# Altium schematic sheet LED and LCD.SchDoc
size A4
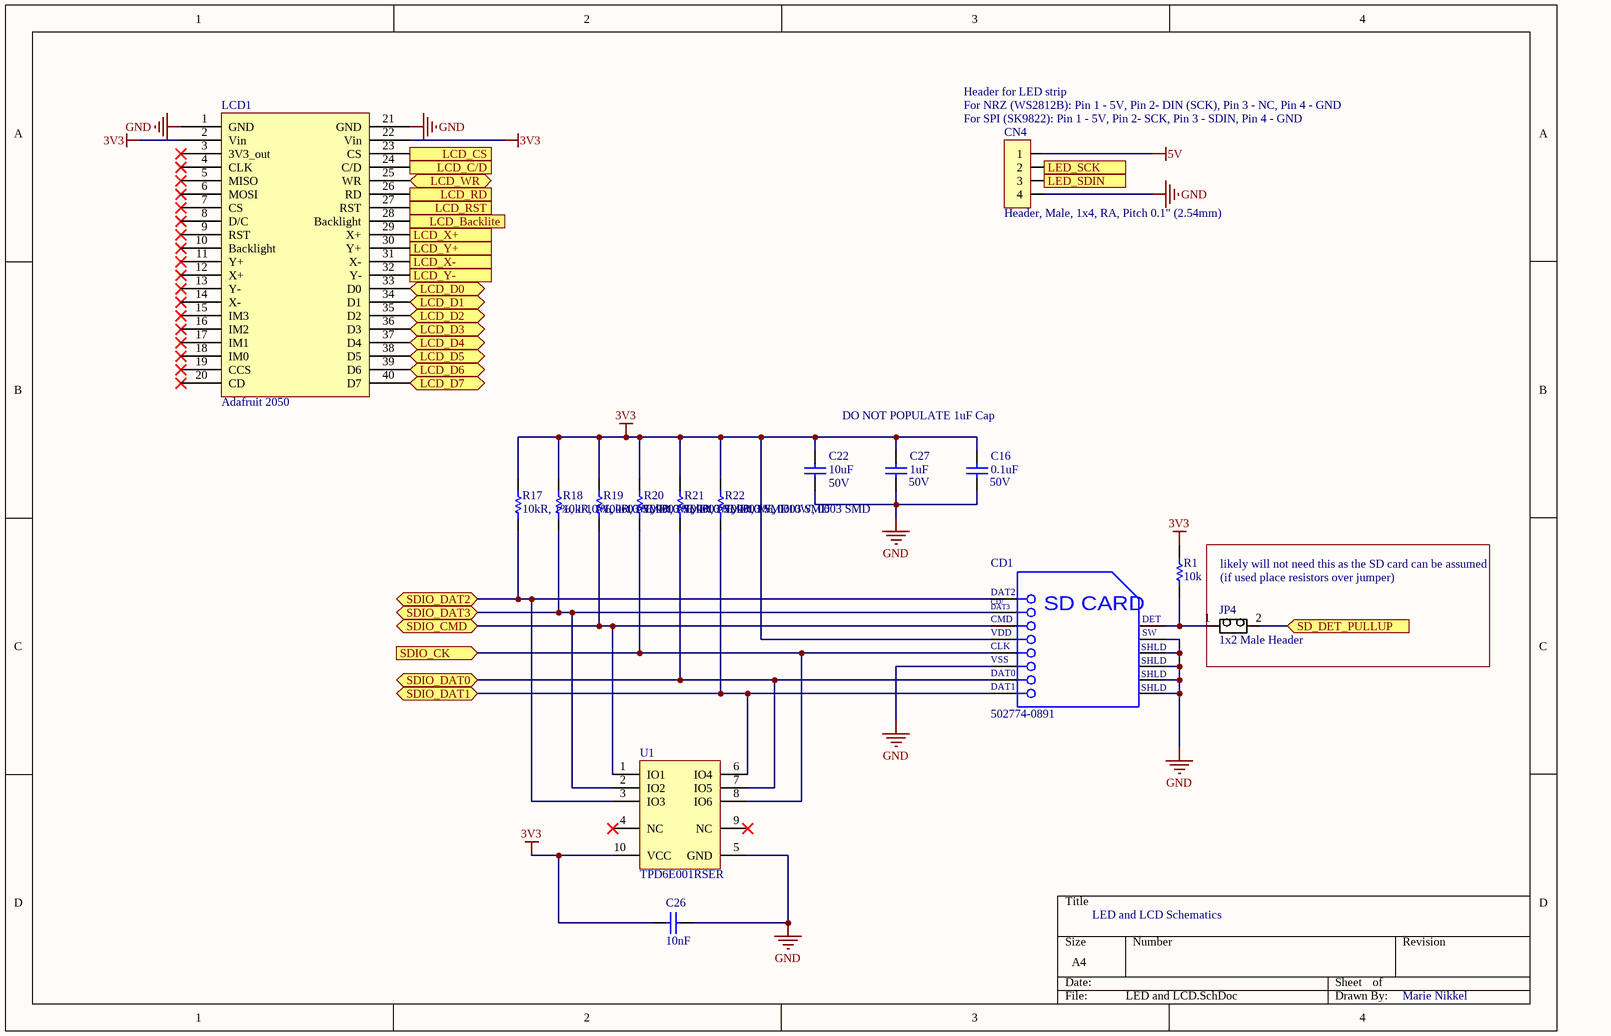
[diagram p0: LED and LCD.SchDoc]

## Parts
C16  Voltage: 50V  Capacitance: 0.1uF  [FP-CL10-0_1-IPC_A]  (hidden comment: CL10B104JB8NNNC)
C22  Voltage Rating (DC): 50V  Capacitance: 10uF  [CAPC3216X180X50ML20T30]  (hidden comment: CL31B106KBHNNNE)
C26  value 10nF  [CAPC1608N(0603")]  (hidden comment: 10 nF, 50V 0603 SMD, Ceramic)
C27  Capacitance: 1uF  Voltage: 50V  [0803 CAP]  (hidden comment: CL21B105KBFNNNG)
CD1  502774-0891  [MOLX-502774-0891_V]
CN4  Header, Male, 1x4, RA, Pitch 0.1" (2.54mm)  [HEADER, MALE, SHROUDED, 4x1, PITCH 0.1" (2.54mm), RA]
JP4  1x2 Male Header  [2X1 Males Header]
LCD1  Adafruit 2050  [LCD_touchscreen_tft]
R1  value 10k  [RESC1608N(0603")]  (hidden comment: 10kR, 1%, 1/10W, 0603 SMD)
R17  10kR, 1%, 1/10W, 0603 SMD  [RESC1608N(0603")]
R18  10kR, 1%, 1/10W, 0603 SMD  [RESC1608N(0603")]
R19  10kR, 1%, 1/10W, 0603 SMD  [RESC1608N(0603")]
R20  10kR, 1%, 1/10W, 0603 SMD  [RESC1608N(0603")]
R21  10kR, 1%, 1/10W, 0603 SMD  [RESC1608N(0603")]
R22  10kR, 1%, 1/10W, 0603 SMD  [RESC1608N(0603")]
U1  TPD6E001RSER  [RSE0010A_V]

## Ports
LCD_Backlite (in), LCD_C/D (in), LCD_CS (in), LCD_D0 (bidir), LCD_D1 (bidir), LCD_D2 (bidir), LCD_D3 (bidir), LCD_D4 (bidir), LCD_D5 (bidir), LCD_D6 (bidir), LCD_D7 (bidir), LCD_RD (in), LCD_RST (in), LCD_WR (bidir), LCD_X+ (out), LCD_X- (out), LCD_Y+ (out), LCD_Y- (out), LED_SCK (in), LED_SDIN (in), SD_DET_PULLUP (in), SDIO_CK (in), SDIO_CMD (bidir), SDIO_DAT0 (bidir), SDIO_DAT1 (bidir), SDIO_DAT2 (bidir), SDIO_DAT3 (bidir)

## Nets
3V3: C16.2 C22.2 C26.1(Anode) C27.2 CD1.4(VDD) LCD1.2(Vin) LCD1.22(Vin) R1.2 R17.2 R18.2 R19.2 R20.2 R21.2 R22.2 U1.10(VCC)
5V: CN4.1
GND: C16.1 C22.1 C26.2(Cathode) C27.1 CD1.6(VSS) CD1.10(SWITCH) CD1.11(SHLD) CD1.12(SHLD) CD1.13(SHLD) CD1.14(SHLD) CN4.4 LCD1.1(GND) LCD1.21(GND) U1.5(GND)
LCD_Backlite: LCD1.28(Backlight) ; port LCD_Backlite
LCD_C/D: LCD1.24(C/D) ; port LCD_C/D
LCD_CS: LCD1.23(CS) ; port LCD_CS
LCD_D0: LCD1.33(D0) ; port LCD_D0
LCD_D1: LCD1.34(D1) ; port LCD_D1
LCD_D2: LCD1.35(D2) ; port LCD_D2
LCD_D3: LCD1.36(D3) ; port LCD_D3
LCD_D4: LCD1.37(D4) ; port LCD_D4
LCD_D5: LCD1.38(D5) ; port LCD_D5
LCD_D6: LCD1.39(D6) ; port LCD_D6
LCD_D7: LCD1.40(D7) ; port LCD_D7
LCD_RD: LCD1.26(RD) ; port LCD_RD
LCD_RST: LCD1.27(RST) ; port LCD_RST
LCD_WR: LCD1.25(WR) ; port LCD_WR
LCD_X+: LCD1.29(X+) ; port LCD_X+
LCD_X-: LCD1.31(X-) ; port LCD_X-
LCD_Y+: LCD1.30(Y+) ; port LCD_Y+
LCD_Y-: LCD1.32(Y-) ; port LCD_Y-
LED_SCK: CN4.2 ; port LED_SCK
LED_SDIN: CN4.3 ; port LED_SDIN
SD_DET_PULLUP: JP4.2 ; port SD_DET_PULLUP
SDIO_CK: CD1.5(CLK) R20.1 U1.8(IO6) ; port SDIO_CK
SDIO_CMD: CD1.3(CMD) R19.1 U1.1(IO1) ; port SDIO_CMD
SDIO_DAT0: CD1.7(DAT0) R21.1 U1.7(IO5) ; port SDIO_DAT0
SDIO_DAT1: CD1.8(DAT1) R22.1 U1.6(IO4) ; port SDIO_DAT1
SDIO_DAT2: CD1.1(DAT2) R17.1 U1.3(IO3) ; port SDIO_DAT2
SDIO_DAT3: CD1.2(CD/DAT3) R18.1 U1.2(IO2) ; port SDIO_DAT3
NetCD1_9: CD1.9(DETECT) JP4.1 R1.1

Not connected (* = marked no-connect by the designer): LCD1 3(3V3_out)* 4(CLK)* 5(MISO)* 6(MOSI)* 7(CS)* 8(D/C)* 9(RST)* 10(Backlight)* 11(Y+)* 12(X+)* 13(Y-)* 14(X-)* 15(IM3)* 16(IM2)* 17(IM1)* 18(IM0)* 19(CCS)* 20(CD)*; U1 4(NC)* 9(NC)*

## Notes on the sheet
- Header for LED strip
- (near CN4) For NRZ (WS2812B): Pin 1 - 5V, Pin 2- DIN (SCK), Pin 3 - NC, Pin 4 - GND
- (near CN4) For SPI (SK9822): Pin 1 - 5V, Pin 2- SCK, Pin 3 - SDIN, Pin 4 - GND
- DO NOT POPULATE 1uF Cap
- likely will not need this as the SD card can be assumed
- (if used place resistors over jumper)
- LED and LCD Schematics
- Marie Nikkel
- (in symbol CMP-2000-05248-1) CD/; DAT3; SD CARD; DET; SW

## Library data of the parts
C16 = CMP-00000-3: CAP CER 0.1UF 50V X7R 0603; Tolerance: 5%; Material: Ceramic; Case Code (Imperial): 0603; Mount: Surface Mount; Thickness: 0.035inch; Depth: 0.8mm; Packaging: Tape and Reel; Package Quantity: 1; Dielectric: X7R; Height: 0.8mm; Radiation Hardening: No; Max Operating Temperature: 125°C; Voltage Rating: 50V; Case/Package: 0603; Min Operating Temperature: -55°C; Case Code (Metric): 1608; Length: 1.6mm; Contact Plating: Tin; Width: 0.031inch
C22 = CMP-00004-1: Cap Ceramic 10uF 50V X7R 10% Pad SMD 1206 125°C T/R; Thickness: 0.071inch; Case/Package: 1206; Case Code (Metric): 3216; Case Code (Imperial): 1206; Voltage Rating: 50V; Length: 0.126inch; Max Operating Temperature: 125°C; Dielectric: X7R; Lead Free: Lead Free; Min Operating Temperature: -55°C; Tolerance: 10%; Mount: Surface Mount; Packaging: Tape and Reel; Width: 0.063inch
C26 = CMP-006-0010-1: Capacitor, Ceramic, 50V, +/- 10%, 0603 SMD; MFG: Samsung; MFG#: GRM188R61A475KE15D; Created By: Gabriel; Design Item ID: 10 nF, 50V 0603 SMD, Ceramic; PackageDescription: Chip Capacitor; Source: AUVic_Schematic_Library_Capacitors.SchLib; Published: 16-06-23; Pin Count: 2; Publisher: AUVic; Component Type: Standard
C27 = CMP-00005-3: SAMSUNG ELECTRO-MECHANICS - CL21B105KBFNNNG - MLCC CAPACITORS; Dielectric: X7R; Tolerance: 10%; Material: Ceramic; Min Operating Temperature: -55°C; Length: 2mm; Termination: Wraparound; Contact Plating: Tin; Package Quantity: 3000; Mount: Surface Mount; Max Operating Temperature: 125°C; Case Code (Imperial): 0805; Thickness: 0.053inch; Case/Package: 0805; Width: 0.049inch; Voltage Rating: 50V; Depth: 1.25mm; Packaging: Tape and Reel; Case Code (Metric): 2012
CD1 = CMP-2000-05248-1: Micro SD Memory Card Connector, 0.5 A, 10 V (DC), -25 to 85 degC, 8-Pin SMT, RoHS, Tape and Reel; Manufacturer: Molex; 3D Model: 502774-0891.stp; Online Catalog: microSD™Series; Number of Positions: 10(8+2); Card Type: SecureDigital-microSD™; Insertion, Removal Method: PushIn,PushOut; Other Names: WM24066DKR; Connector Type: ConnectorandEjector; Features: Switch; Family: MemoryConnectors-PCCardSockets; Manufacturer URL: http://www.molex.com/; Mounting Type: SurfaceMount,RightAngle; Contact Finish Thickness: 20µin(0.51µm); Standard Package: 1; Series: 502774; Ejector Side: -; Datasheet Version: Rev. D, 04/2004; Category: Connectors,Interconnects; Contact Finish: Gold; Datasheet URL: https://datasheet.ciiva.com/1104/1499551-1104671.pdf; RoHS Information: 502774-0891CertofCompliance; Mounting Feature: Reverse-Bottom; Packaging: Digi-Reel; Height Above Board: 0.071"(1.80mm); Catalog Drawings: 502774-0891
CN4 = CMP-005-0029-3: Connector Header Through Hole, Right Angle 4 position 0.100" (2.54mm); Pin Count: 4; Source: AUVic_Schematic_Library_Connectors.SchLib; Created On: 2020-05-20; Design Item ID: Header, Male, 1x4, RA, Pitch 0.1" (2.54mm); Component Type: Standard; Created By: Miguel Manguerra
JP4 = CMP-004-0001-1: Made By: Andy Bates; Source: AUVic_Schematic_Library_Connectors.SchLib; Pin Count: 2; Design Item ID: 1x2 Male Header; Component Type: Standard
LCD1 = CMP-033-0000-6: 3.5" TFT 320X480 TOUCHSCREEN; Component Type: Standard; ComponentLink5Description: Adafruit Guide; ComponentLink1URL: https://www.adafruit.com/product/1743; ComponentLink2URL: https://cdn-shop.adafruit.com/datasheets/ILI9341.pdf; ComponentLink3URL: https://cdn-shop.adafruit.com/datasheets/MI0283QT-11+V1.1.PDF; ComponentLink4URL: https://www.digikey.ca/products/en/optoelectronics/display-modules-lcd-oled-graphic/107?k=&pkeyword=&pv652=165&FV=ffe0006b%2Cfffc05f8&quantity=0&ColumnSort=0&page=1&pageSize=25; ComponentLink3Description: Raw LCD Datasheet; ComponentLink4Description: DigiKey; Pin Count: 40; ComponentLink5URL: https://cdn-learn.adafruit.com/downloads/pdf/adafruit-2-dot-8-color-tft-touchscreen-breakout-v2.pdf; ComponentLink1Description: Adafruit; Design Item ID: Adafruit 2050; ComponentLink2Description: Datasheet; Source: AUVic_Integrated_Library_LCDs.SchLib
R1 = CMP-047-0013-1: Owned By: AUVic; Made By: Ashwin Sira; Design Item ID: 10kR, 1%, 1/10W, 0603 SMD; Pin Count: 2; Component Type: Standard; Created On: 14-05-31; Last Edited: 14-05-31; Source: AUVic_Schematic_Library_Resistors.SchLib
R17-R22 = CMP-047-0013-1: Owned By: AUVic; Made By: Ashwin Sira; Value: 10k; Design Item ID: 10kR, 1%, 1/10W, 0603 SMD; Pin Count: 2; Component Type: Standard; Created On: 14-05-31; Last Edited: 14-05-31; Source: AUVic_Schematic_Library_Resistors.SchLib
U1 = CMP-0326-00011-3: Low-Capacitance + / - 15 kV ESD Protection Array for High-Speed Data Interfaces, 6 Channels, -40 to +85 degC, 10-pin UQFN (RSE), Green (RoHS & no Sb/Br); Manufacturer: Texas Instruments; IO Capacitance(Typ)(pF): 1.5; IEC 61000-4-2 Contact(+/- kV): 8; IO Leakage Current(nA): 1; Serial ATA / eSATA: TRUE; Breakdown Voltage(Min)(V): 11; IEC 61000-4-2 Air-Gap(+/- kV): 15; SubFamily: ESD Solution; ComponentLink1Description: Manufacturer URL; Eco-Plan: Green (RoHS & no Sb/Br); PackageVersion: revD, Jan-2011; PackageReference: RSE0010A; ComponentLink3URL: SamplesURL:http://www.ti.com/product/tpd6e001#samples; Mounting Technology: Surface Mount; ComponentLink2URL: http://www.ti.com/general/docs/lit/getliterature.tsp?genericPartNumber=TPD6E001&fileType=pdf; PackageDescription: 10-Leads Plastic Quad Flatpack No-Lead, 2 x 1.5 x 0.55 mm Body, 0.5 mm Pitch; ComponentLink2Description: Datasheet; USB High Speed: TRUE; ComponentLink3Description: URL Link1; DatasheetVersion: SLLS685C; ComponentLink1URL: http://www.ti.com/; PartNumber: TPD6E001RSER; 1394 / Firewire: TRUE